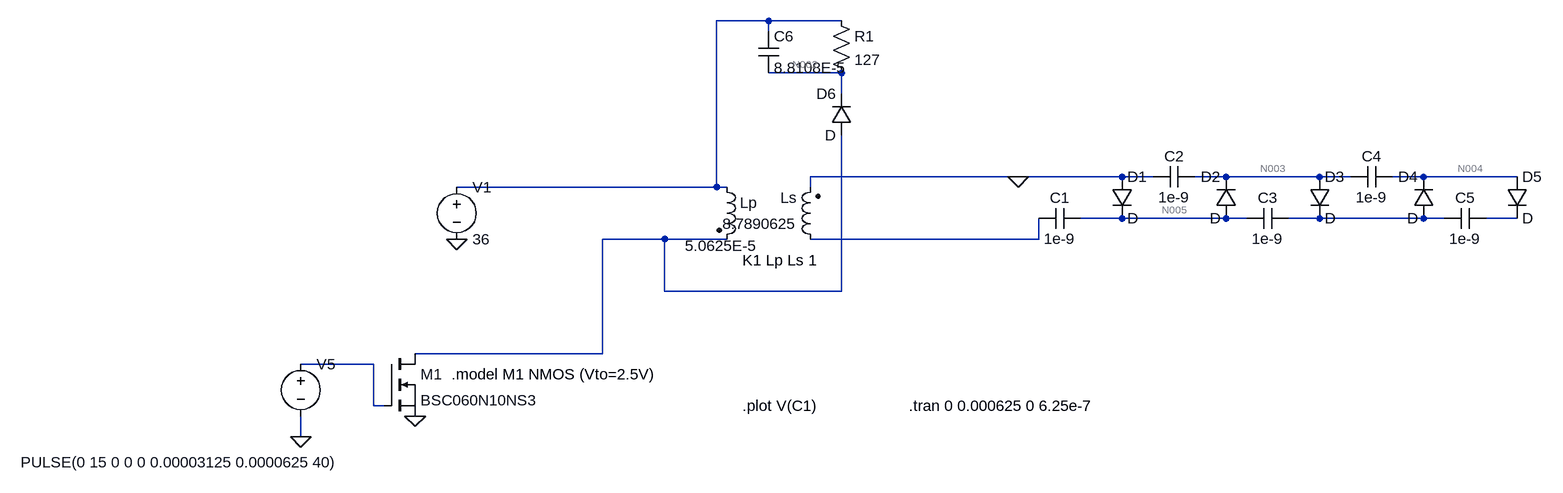
[diagram p0: schematic VillardCascadingModel3.asc]
VillardCascadingModel3.asc, the LTspice schematic file:
Version 4
SHEET 1 880 832
WIRE -624 -192 -704 -192
WIRE -512 -192 -624 -192
WIRE -624 -176 -624 -192
WIRE -512 -112 -624 -112
WIRE -512 -80 -512 -112
WIRE -240 48 -560 48
WIRE -80 48 -240 48
WIRE -32 48 -80 48
WIRE 80 48 32 48
WIRE 224 48 80 48
WIRE 272 48 224 48
WIRE 384 48 336 48
WIRE 528 48 384 48
WIRE -704 64 -704 -192
WIRE -704 64 -1104 64
WIRE -688 64 -704 64
WIRE -560 64 -560 48
WIRE -80 112 -144 112
WIRE 80 112 -80 112
WIRE 112 112 80 112
WIRE 224 112 176 112
WIRE 384 112 224 112
WIRE 416 112 384 112
WIRE 528 112 480 112
WIRE -784 144 -880 144
WIRE -688 144 -784 144
WIRE -208 144 -208 112
WIRE -208 144 -560 144
WIRE -784 224 -784 144
WIRE -512 224 -512 -16
WIRE -512 224 -784 224
WIRE -880 320 -880 144
WIRE -880 320 -1168 320
WIRE -1232 336 -1344 336
WIRE -1232 400 -1232 336
WIRE -1216 400 -1232 400
WIRE -1344 448 -1344 416
FLAG -240 48 0
FLAG -1104 144 0
FLAG -1344 448 0
FLAG -1168 416 0
SYMBOL diode -96 48 R0
SYMATTR InstName D1
SYMBOL diode 96 112 R180
WINDOW 0 24 64 Left 2
WINDOW 3 24 0 Left 2
SYMATTR InstName D2
SYMBOL diode 208 48 R0
SYMATTR InstName D3
SYMBOL diode 400 112 R180
WINDOW 0 24 64 Left 2
WINDOW 3 24 0 Left 2
SYMATTR InstName D4
SYMBOL cap -144 96 R90
WINDOW 0 0 32 VBottom 2
WINDOW 3 32 32 VTop 2
SYMATTR InstName C1
SYMATTR Value 1e-9
SYMBOL cap 32 32 R90
WINDOW 0 0 32 VBottom 2
WINDOW 3 32 32 VTop 2
SYMATTR InstName C2
SYMATTR Value 1e-9
SYMBOL cap 176 96 R90
WINDOW 0 0 32 VBottom 2
WINDOW 3 32 32 VTop 2
SYMATTR InstName C3
SYMATTR Value 1e-9
SYMBOL cap 336 32 R90
WINDOW 0 0 32 VBottom 2
WINDOW 3 32 32 VTop 2
SYMATTR InstName C4
SYMATTR Value 1e-9
SYMBOL cap 480 96 R90
WINDOW 0 0 32 VBottom 2
WINDOW 3 32 32 VTop 2
SYMATTR InstName C5
SYMATTR Value 1e-9
SYMBOL diode 512 48 R0
SYMATTR InstName D5
SYMBOL ind2 -704 48 R0
WINDOW 3 -49 106 Left 2
SYMATTR Value 5.0625E-5
SYMATTR InstName Lp
SYMATTR Type ind
SYMBOL ind2 -544 160 R180
WINDOW 0 36 80 Left 2
WINDOW 3 36 40 Left 2
SYMATTR InstName Ls
SYMATTR Value 8.7890625
SYMATTR Type ind
SYMBOL voltage -1104 48 R0
WINDOW 123 0 0 Left 0
WINDOW 39 0 0 Left 0
SYMATTR InstName V1
SYMATTR Value 36
SYMBOL voltage -1344 320 R0
WINDOW 3 -431 167 Left 2
WINDOW 123 0 0 Left 0
WINDOW 39 0 0 Left 0
SYMATTR Value PULSE(0 15 0 0 0 0.00003125 0.0000625 40)
SYMATTR InstName V5
SYMBOL nmos -1216 320 R0
SYMATTR InstName M1
SYMATTR Value BSC060N10NS3
SYMBOL res -528 -208 R0
SYMATTR InstName R1
SYMATTR Value 127
SYMBOL cap -640 -176 R0
SYMATTR InstName C6
SYMATTR Value 8.8108E-5
SYMBOL diode -496 -16 R180
WINDOW 0 24 64 Left 2
WINDOW 3 24 0 Left 2
SYMATTR InstName D6
TEXT -408 400 Left 2 !.tran 0 0.000625 0 6.25e-7
TEXT -664 400 Left 2 !.plot V(C1)
TEXT -664 176 Left 2 !K1 Lp Ls 1
TEXT -1112 352 Left 2 !.model M1 NMOS (Vto=2.5V)

The netlist it stands for:
* VillardCascadingModel3.asc
D1 0 N005 D
D2 N005 N003 D
D3 N003 N006 D
D4 N006 N004 D
C1 N005 N009 1e-9
C2 N003 0 1e-9
C3 N006 N005 1e-9
C4 N004 N003 1e-9
C5 N007 N006 1e-9
D5 N004 N007 D
Lp N001 N008 5.0625E-5
Ls N009 0 8.7890625
V1 N001 0 36
V5 N010 0 PULSE(0 15 0 0 0 0.00003125 0.0000625 40)
M1 N008 N010 0 0 BSC060N10NS3
R1 N001 N002 127
C6 N001 N002 8.8108E-5
D6 N008 N002 D
.model D D
.lib standard.dio
.model NMOS NMOS
.model PMOS PMOS
.lib standard.mos
.tran 0 0.000625 0 6.25e-7
.plot V(C1)
K1 Lp Ls 1
.model M1 NMOS (Vto=2.5V)
.backanno
.end

* Results of the author's LTspice run, read from the files saved beside the schematic
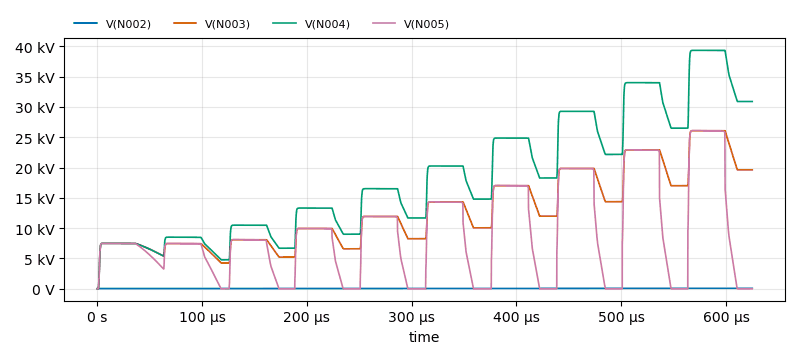
[diagram p1: Transient Analysis of VillardCascadingModel3.asc, plotted from the saved traces]
* Transient Analysis, 1 run:
*   V(N002): min 36 V, max 92.37 V, average 52.25 V, rms 55.13 V, last 92.37 V
*   V(N003): min 0 V, max 26.08 kV, average 12.96 kV, rms 14.36 kV, last 19.61 kV
*   V(N004): min 0 V, max 39.32 kV, average 18.34 kV, rms 20.96 kV, last 30.89 kV
*   V(N005): min -818.3 mV, max 26.08 kV, average 9.113 kV, rms 12.07 kV, last -805.9 mV